# EAGLE schematic Arduino_as_ISP (EAGLE 9.6.2)
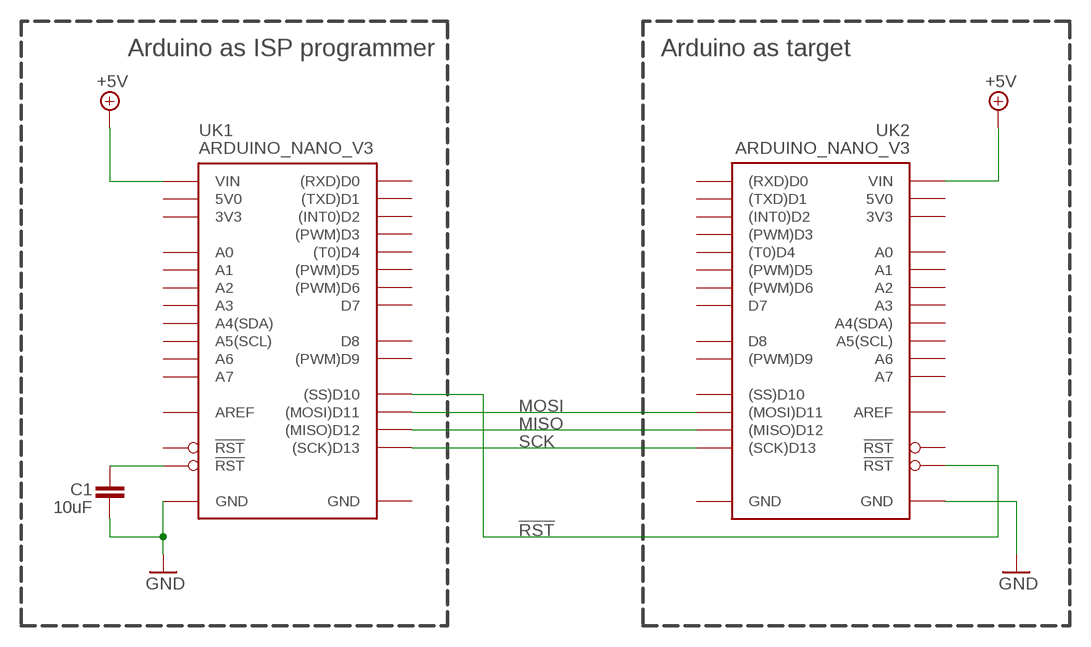
[diagram p0: schematic, sheet 1]

## Parts
C1  10uF  C  (no package)
UK1  ARDUINO_NANO_V3  [ARDUINO_NANO]
UK2  ARDUINO_NANO_V3  [ARDUINO_NANO]

## Nets
!RST: UK1.28((SS)D10) UK2.18(!RST)
+5V: UK1.15(VIN) UK2.15(VIN)
GND: C1.1 UK1.14(GND) UK2.14(GND)
MISO: UK1.30((MISO)D12) UK2.30((MISO)D12)
MOSI: UK1.29((MOSI)D11) UK2.29((MOSI)D11)
N$1: C1.2 UK1.18(!RST)
SCK: UK1.1((SCK)D13) UK2.1((SCK)D13)
Unconnected: UK1.2(3V3) UK1.3(AREF) UK1.4(A0) UK1.5(A1) UK1.6(A2) UK1.7(A3) UK1.8(A4(SDA)) UK1.9(A5(SCL)) UK1.10(A6) UK1.11(A7) UK1.12(5V0) UK1.13(!RST) UK1.16((TXD)D1) UK1.17((RXD)D0) UK1.19(GND) UK1.20((INT0)D2) UK1.21((PWM)D3) UK1.22((T0)D4) UK1.23((PWM)D5) UK1.24((PWM)D6) UK1.25(D7) UK1.26(D8) UK1.27((PWM)D9) UK2.2(3V3) UK2.3(AREF) UK2.4(A0) UK2.5(A1) UK2.6(A2) UK2.7(A3) UK2.8(A4(SDA)) UK2.9(A5(SCL)) UK2.10(A6) UK2.11(A7) UK2.12(5V0) UK2.13(!RST) UK2.16((TXD)D1) UK2.17((RXD)D0) UK2.19(GND) UK2.20((INT0)D2) UK2.21((PWM)D3) UK2.22((T0)D4) UK2.23((PWM)D5) UK2.24((PWM)D6) UK2.25(D7) UK2.26(D8) UK2.27((PWM)D9) UK2.28((SS)D10)

## Notes on the sheet
- Arduino as ISP programmer | Arduino as target

## Library data of the parts
C1 = ngspice-simulation:C: CAPACITOR
UK1 UK2 = Arduino_DWD:ARDUINO_NANO_V3